# Altium schematic sheet Connector.SchDoc
size A3
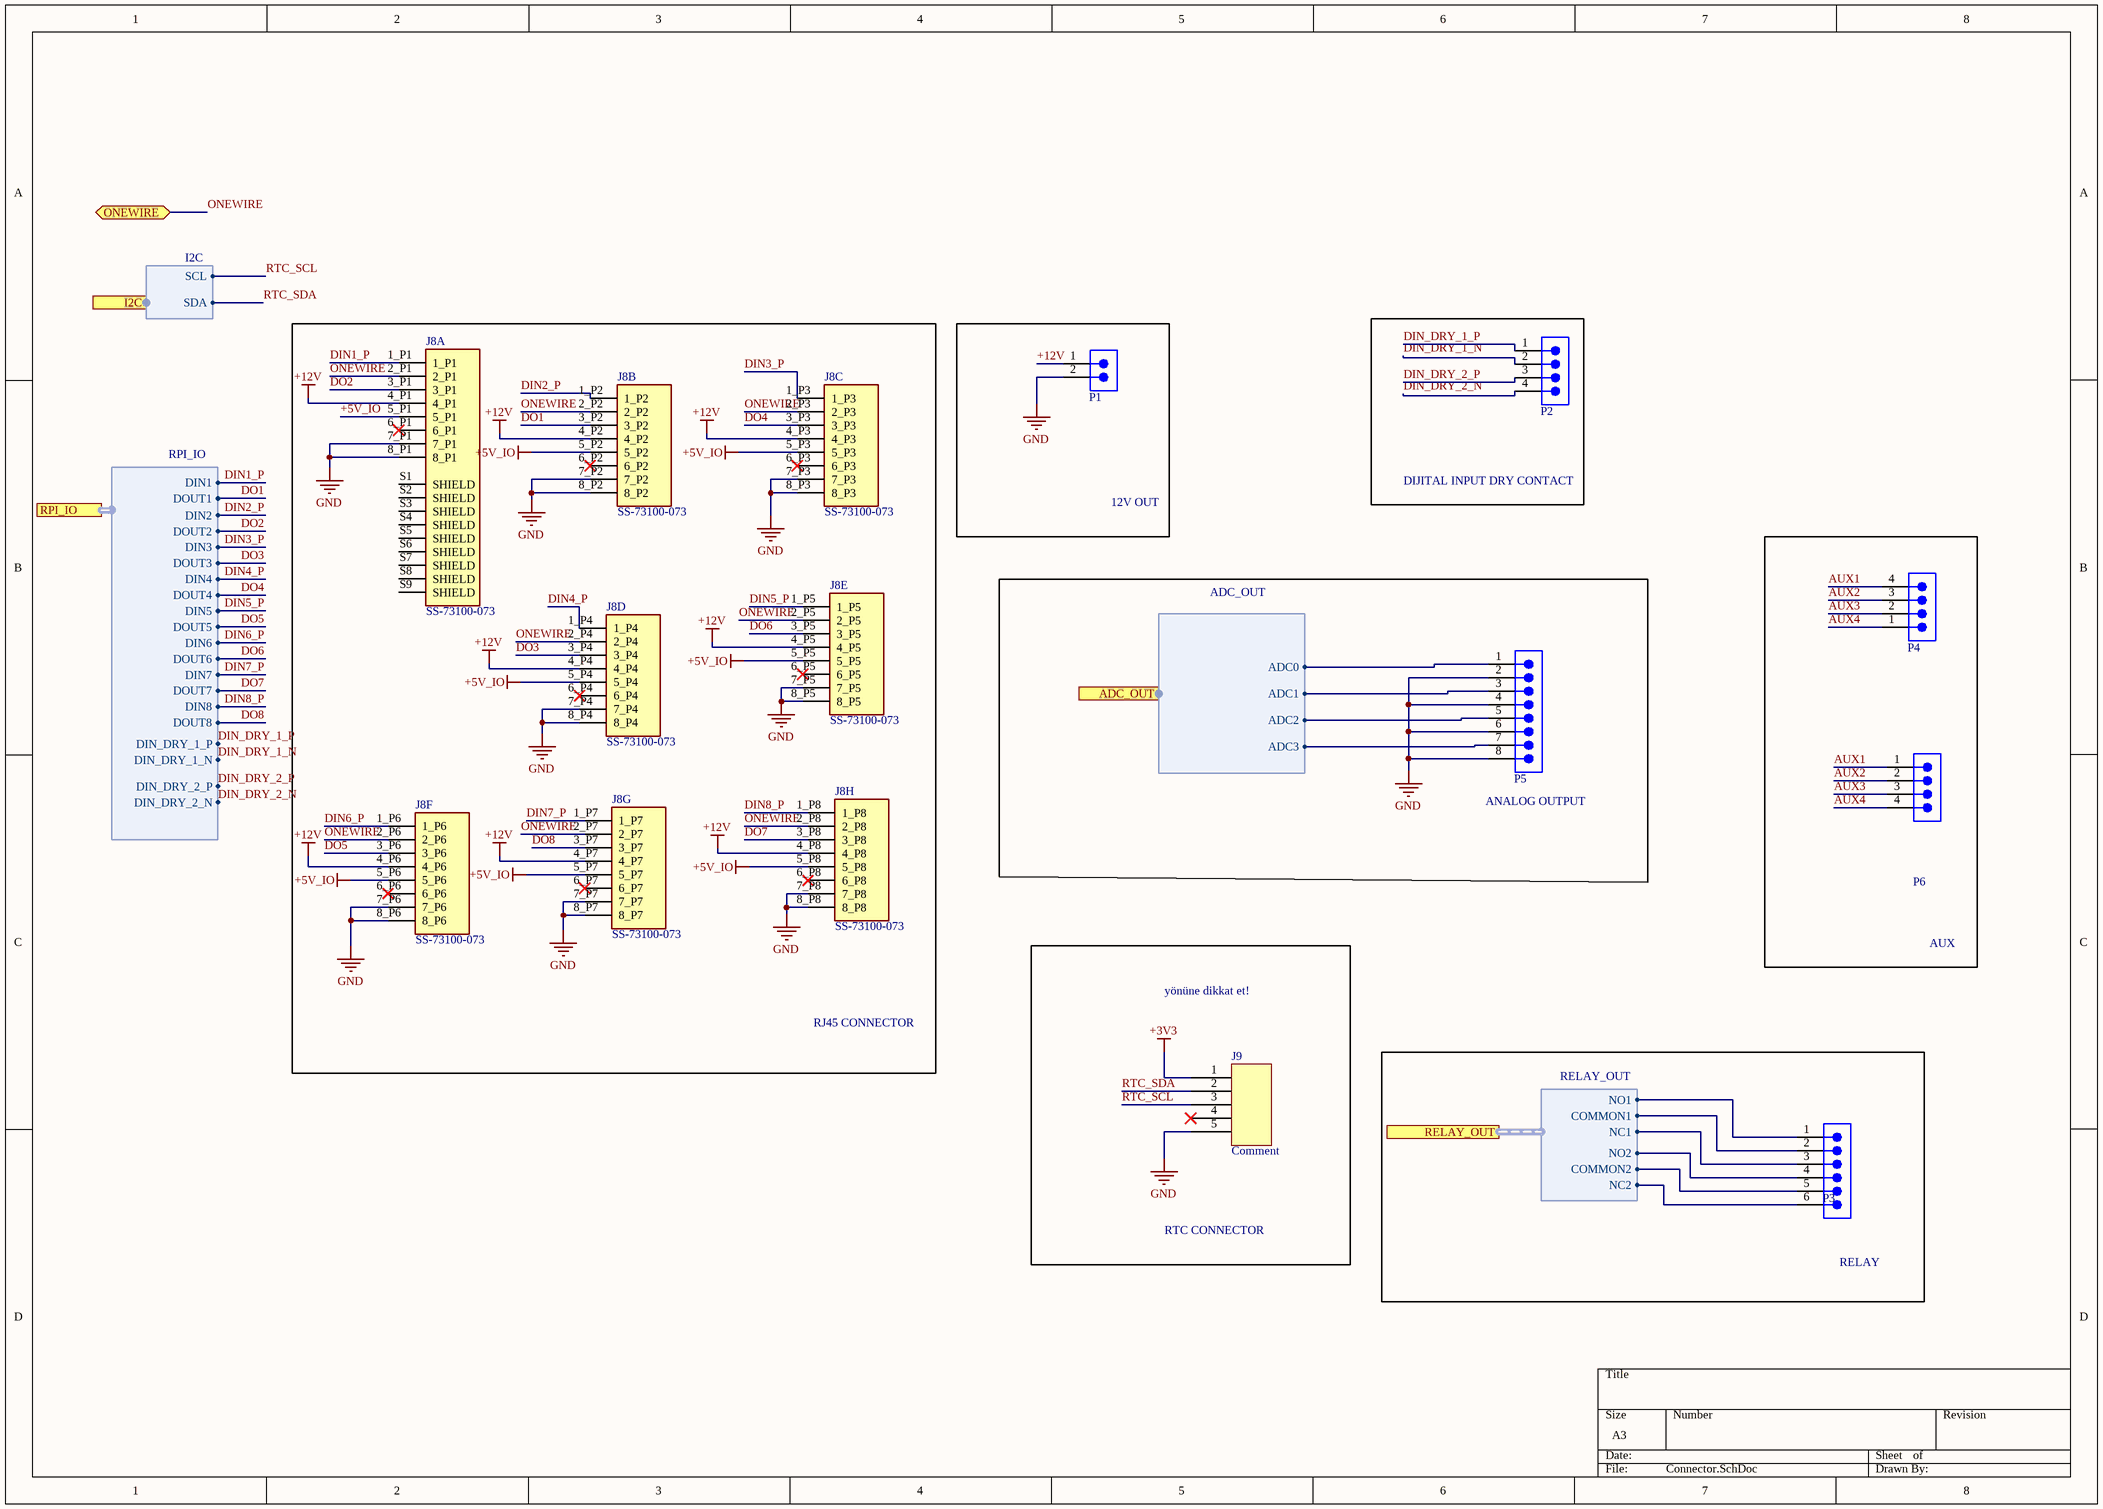
[diagram p0: Connector.SchDoc]

## Parts
J8  SS-73100-073  [BEL_SS-73100-073]  (parts A,B,C,D,E,F,G,H of 8)
J9  Comment  [2.54_5P]
P1  691322310002  [691322310002]  (value not drawn)
P2  691322310004  [691322310004]  (value not drawn)
P3  691305540006  [691305540006]  (value not drawn)
P4  691322310004  [691322310004]  (value not drawn)
P5  691322310008  [691322310008]  (value not drawn)
P6  691322310004  [691322310004]  (value not drawn)

## Blocks framed on the sheet
RJ45 CONNECTOR: J8
12V OUT: P1
DIJITAL INPUT DRY CONTACT: P2
AUX: P4 P6
ANALOG OUTPUT: P5
RELAY: P3

## Ports
ADC_OUT (harness ADC_OUT), I2C (harness I2C), ONEWIRE (bidir), RELAY_OUT (harness RELAY_OUT), RPI_IO (harness RPI_IO)

## Harnesses
ADC_OUT: ADC3, ADC2, ADC1, ADC0
I2C: SCL, SDA
RPI_IO: DIN1, DOUT1, DIN2, DOUT2, DIN3, DOUT3, DIN4, DOUT4, DIN5, DOUT5, DIN6, DOUT6, DIN7, DOUT7, DIN8, DOUT8, DIN_DRY_1_P, DIN_DRY_1_N, DIN_DRY_2_N, DIN_DRY_2_P
RELAY_OUT: COMMON1, NC1, NO1, NC2, COMMON2, NO2

## Nets
+3V3: J9.1
+5V_IO: J8.5_P1 J8.5_P2 J8.5_P3 J8.5_P4 J8.5_P5 J8.5_P6 J8.5_P7 J8.5_P8
+12V: J8.4_P1 J8.4_P2 J8.4_P3 J8.4_P4 J8.4_P5 J8.4_P6 J8.4_P7 J8.4_P8 P1.1
GND: J8.7_P1 J8.7_P2 J8.7_P3 J8.7_P4 J8.7_P5 J8.7_P6 J8.7_P7 J8.7_P8 J8.8_P1 J8.8_P2 J8.8_P3 J8.8_P4 J8.8_P5 J8.8_P6 J8.8_P7 J8.8_P8 J9.5 P1.2 P5.2 P5.4 P5.6 P5.8
AUX1: P4.4 P6.1
AUX2: P4.3 P6.2
AUX3: P4.2 P6.3
AUX4: P4.1 P6.4
DIN1_P: J8.1_P1 ; port RPI_IO.DIN1
DIN2_P: J8.1_P2 ; port RPI_IO.DIN2
DIN3_P: J8.1_P3 ; port RPI_IO.DIN3
DIN4_P: J8.1_P4 ; port RPI_IO.DIN4
DIN5_P: J8.1_P5 ; port RPI_IO.DIN5
DIN6_P: J8.1_P6 ; port RPI_IO.DIN6
DIN7_P: J8.1_P7 ; port RPI_IO.DIN7
DIN8_P: J8.1_P8 ; port RPI_IO.DIN8
DIN_DRY_1_N: P2.2 ; port RPI_IO.DIN_DRY_1_N
DIN_DRY_1_P: P2.1 ; port RPI_IO.DIN_DRY_1_P
DIN_DRY_2_N: P2.4 ; port RPI_IO.DIN_DRY_2_N
DIN_DRY_2_P: P2.3 ; port RPI_IO.DIN_DRY_2_P
DO1: J8.3_P2 ; port RPI_IO.DOUT1
DO2: J8.3_P1 ; port RPI_IO.DOUT2
DO3: J8.3_P4 ; port RPI_IO.DOUT3
DO4: J8.3_P3 ; port RPI_IO.DOUT4
DO5: J8.3_P6 ; port RPI_IO.DOUT5
DO6: J8.3_P5 ; port RPI_IO.DOUT6
DO7: J8.3_P8 ; port RPI_IO.DOUT7
DO8: J8.3_P7 ; port RPI_IO.DOUT8
ONEWIRE: J8.2_P1 J8.2_P2 J8.2_P3 J8.2_P4 J8.2_P5 J8.2_P6 J8.2_P7 J8.2_P8 ; port ONEWIRE
RTC_SCL: J9.3 ; port I2C.SCL
RTC_SDA: J9.2 ; port I2C.SDA
NetP3_1: P3.1 ; port RELAY_OUT.NO1
NetP3_2: P3.2 ; port RELAY_OUT.COMMON1
NetP3_3: P3.3 ; port RELAY_OUT.NC1
NetP3_4: P3.4 ; port RELAY_OUT.NO2
NetP3_5: P3.5 ; port RELAY_OUT.COMMON2
NetP3_6: P3.6 ; port RELAY_OUT.NC2
NetP5_1: P5.1 ; port ADC_OUT.ADC0
NetP5_3: P5.3 ; port ADC_OUT.ADC1
NetP5_5: P5.5 ; port ADC_OUT.ADC2
NetP5_7: P5.7 ; port ADC_OUT.ADC3

Not connected (* = marked no-connect by the designer): J8 6_P1* 6_P2* 6_P3* 6_P4* 6_P5* 6_P6* 6_P7* 6_P8* S1(SHIELD) S2(SHIELD) S3(SHIELD) S4(SHIELD) S5(SHIELD) S6(SHIELD) S7(SHIELD) S8(SHIELD) S9(SHIELD); J9 4*

## Notes on the sheet
- yönüne dikkat et!
- RTC CONNECTOR

## Library data of the parts
J8 = SS-73100-073: Jack Modular Connector RJ45, Ethernet RA; MF: Stewart Connector; Que: 174; SnapEDA_Link: https://www.snapeda.com/parts/SS-73100-073/Stewart%20Connector/view-part/79069/?ref=snap; MP: SS-73100-073; Digi-Key_Part_Number: SS-73100-073F-ND; Package: None; Value: *; Check_prices: https://www.snapeda.com/parts/SS-73100-073/Stewart%20Connector/view-part/79069/?ref=eda; Part Number: SS-73100-073
J9 = 2.54_5P_HDR: Que: 091; Part Number: 2.54_5P_HDR
P1 = 691322310002: WR-TBL Series 322 - 3.81 mm Horizontal 2 pin; Manufacturer: Wurth Elektronik; Modularity: No; Pitch: 3.81mm; Rated Current: 10A; Working Voltage: 300V; Que: 170; ComponentLink1Description: Website Link; ComponentLink1URL: https://www.we-online.com/redexpert/article/691322310002?ad; ComponentLink2Description: Datasheet Link; ComponentLink2URL: https://www.we-online.com/redexpert/spec/691322310002?ad; Manufacturer Part Number: 691322310002; Category: Terminal Blocks; Match Code: WR-TBL; Mount: Through Hole; Operating Temperature Max: 105°C; Operating Temperature Min: -40°C; Packaging: Box; Application: Pluggable; Number of Pins: 2; Number of Rows: 1; Orientation: Horizontal; Part Number: 691322310002
P2 P4 P6 = 691322310004: WR-TBL Series 322 - 3.81 mm Horizontal; Manufacturer: Wurth Elektronik; Modularity: No; Pitch: 3.81mm; Rated Current: 10A; Working Voltage: 300V; Que: 169; ComponentLink1Description: Website Link; ComponentLink1URL: https://www.we-online.com/redexpert/article/691322310004?ad; ComponentLink2Description: Datasheet Link; ComponentLink2URL: https://www.we-online.com/redexpert/spec/691322310004?ad; Manufacturer Part Number: 691322310004; Category: Terminal Blocks; Match Code: WR-TBL; Mount: Through Hole; Operating Temperature Max: 105°C; Operating Temperature Min: -40°C; Packaging: Box; Application: Pluggable; Number of Pins: 4; Number of Rows: 1; Orientation: Horizontal; Part Number: 691322310004
P3 = 691305540006: WR-TBL Series 3055 - 5.08 mm 6 pin; Manufacturer: Wurth Elektronik; Modularity: No; Pitch: 5.08mm; Rated Current: 16A; Working Voltage: 300V; Que: 161; ComponentLink1Description: Website Link; ComponentLink1URL: https://www.we-online.com/redexpert/article/691305540006?ad; ComponentLink2Description: Datasheet Link; ComponentLink2URL: https://www.we-online.com/redexpert/spec/691305540006?ad; Manufacturer Part Number: 691305540006; Category: Terminal Blocks; Match Code: WR-TBL; Mount: Through Hole; Operating Temperature Max: 105°C; Operating Temperature Min: -40°C; Packaging: Box; Application: Pluggable; Number of Pins: 6; Number of Rows: 1; Orientation: Horizontal; Part Number: 691305540006
P5 = 691322310008: WR-TBL Series 322 - 3.81 mm Horizontal 8 pin; Manufacturer: Wurth Elektronik; Modularity: No; Pitch: 3.81mm; Rated Current: 10A; Working Voltage: 300V; Que: 172; ComponentLink1Description: Website Link; ComponentLink1URL: https://www.we-online.com/redexpert/article/691322310008?ad; ComponentLink2Description: Datasheet Link; ComponentLink2URL: https://www.we-online.com/redexpert/spec/691322310008?ad; Manufacturer Part Number: 691322310008; Category: Terminal Blocks; Match Code: WR-TBL; Mount: Through Hole; Operating Temperature Max: 105°C; Operating Temperature Min: -40°C; Packaging: Box; Application: Pluggable; Number of Pins: 8; Number of Rows: 1; Orientation: Horizontal; Part Number: 691322310008